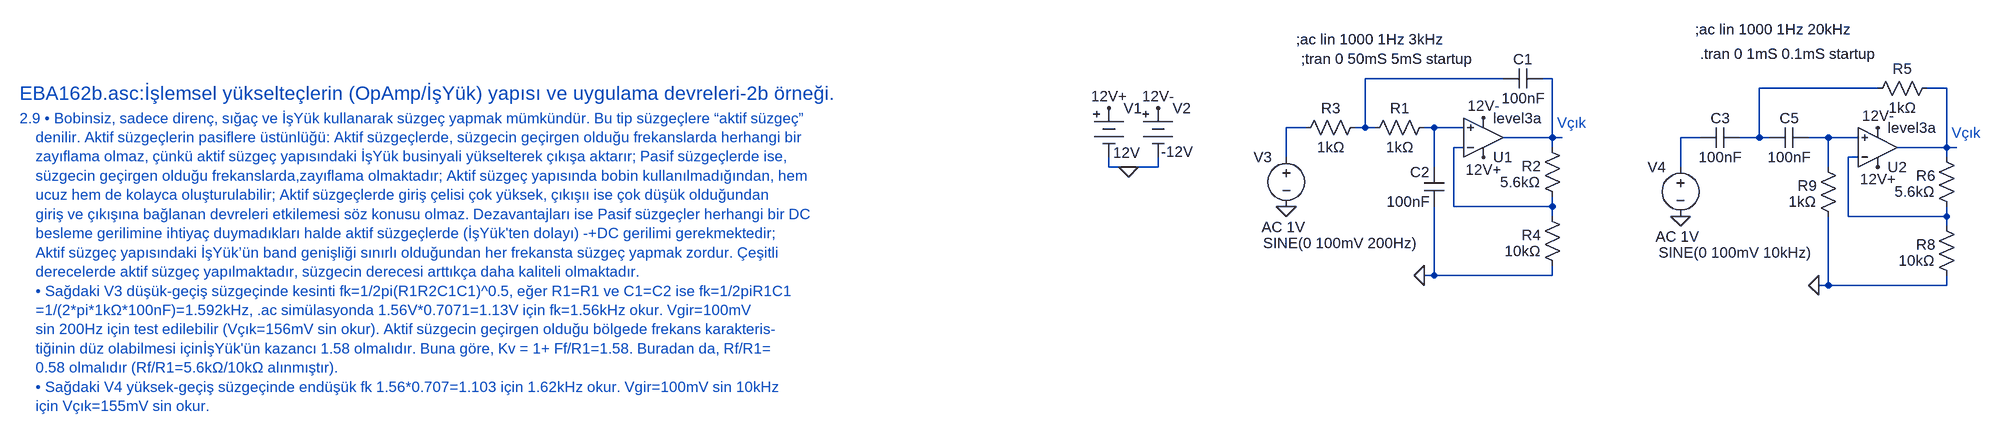
[diagram p0: schematic EBA162b.asc]
EBA162b.asc, the LTspice schematic file:
Version 4
SHEET 1 6044 4332
WIRE 2176 32 1952 32
WIRE 2256 32 2240 32
WIRE 2784 48 2592 48
WIRE 2896 48 2864 48
WIRE 1856 112 1824 112
WIRE 1952 112 1952 32
WIRE 1952 112 1936 112
WIRE 1968 112 1952 112
WIRE 2064 112 2048 112
WIRE 2112 112 2064 112
WIRE 2256 128 2256 32
WIRE 2256 128 2176 128
WIRE 2272 128 2256 128
WIRE 2496 128 2464 128
WIRE 2592 128 2592 48
WIRE 2592 128 2560 128
WIRE 2608 128 2592 128
WIRE 2704 128 2672 128
WIRE 2752 128 2704 128
WIRE 2112 144 2096 144
WIRE 2256 144 2256 128
WIRE 2896 144 2896 48
WIRE 2896 144 2816 144
WIRE 2912 144 2896 144
WIRE 1824 160 1824 112
WIRE 2752 160 2736 160
WIRE 2896 160 2896 144
WIRE 1536 176 1536 160
WIRE 1568 176 1536 176
WIRE 1616 176 1616 160
WIRE 1616 176 1568 176
WIRE 2064 176 2064 112
WIRE 2464 176 2464 128
WIRE 2704 176 2704 128
WIRE 2096 240 2096 144
WIRE 2256 240 2256 224
WIRE 2256 240 2096 240
WIRE 2256 256 2256 240
WIRE 2736 256 2736 160
WIRE 2896 256 2896 240
WIRE 2896 256 2736 256
WIRE 2896 272 2896 256
WIRE 2064 352 2064 240
WIRE 2064 352 2048 352
WIRE 2256 352 2256 336
WIRE 2256 352 2064 352
WIRE 2704 368 2704 256
WIRE 2704 368 2688 368
WIRE 2896 368 2896 352
WIRE 2896 368 2704 368
FLAG 1536 80 12V+
FLAG 1616 80 12V-
FLAG 1568 176 0
FLAG 2144 160 12V+
FLAG 1824 240 0
FLAG 2048 352 0
FLAG 2144 96 12V-
FLAG 2784 176 12V+
FLAG 2464 256 0
FLAG 2688 368 0
FLAG 2784 112 12V-
SYMBOL Misc\\battery 1536 64 R0
WINDOW 3 7 88 Left 2
SYMATTR Value 12V
SYMATTR InstName V1
SYMBOL Misc\\battery 1616 64 R0
WINDOW 3 5 87 Left 2
SYMATTR Value -12V
SYMATTR InstName V2
SYMBOL res 2064 96 R90
WINDOW 0 0 56 VBottom 2
WINDOW 3 32 56 VTop 2
SYMATTR InstName R1
SYMATTR Value 1kΩ
SYMBOL OpAmps\\UniversalOpAmp3 2144 128 M180
SYMATTR InstName U1
SYMBOL res 2272 240 R180
WINDOW 0 35 66 Left 2
WINDOW 3 36 40 Left 2
SYMATTR InstName R2
SYMATTR Value 5.6kΩ
SYMBOL cap 2240 16 R90
WINDOW 0 0 32 VBottom 2
WINDOW 3 32 32 VTop 2
SYMATTR InstName C1
SYMATTR Value 100nF
SYMBOL res 1952 96 R90
WINDOW 0 0 56 VBottom 2
WINDOW 3 32 56 VTop 2
SYMATTR InstName R3
SYMATTR Value 1kΩ
SYMBOL voltage 1824 144 M0
WINDOW 3 -208 155 Left 2
WINDOW 123 -29 129 Left 2
WINDOW 39 0 0 Left 0
SYMATTR InstName V3
SYMATTR Value SINE(0 100mV 200Hz)
SYMATTR Value2 AC 1V
SYMBOL res 2272 352 R180
WINDOW 0 35 66 Left 2
WINDOW 3 36 40 Left 2
SYMATTR InstName R4
SYMATTR Value 10kΩ
SYMBOL cap 2080 240 R180
WINDOW 0 24 56 Left 2
WINDOW 3 24 8 Left 2
SYMATTR InstName C2
SYMATTR Value 100nF
SYMBOL res 2880 32 R90
WINDOW 0 0 56 VBottom 2
WINDOW 3 32 56 VTop 2
SYMATTR InstName R5
SYMATTR Value 1kΩ
SYMBOL OpAmps\\UniversalOpAmp3 2784 144 M180
SYMATTR InstName U2
SYMBOL res 2912 256 R180
WINDOW 0 35 66 Left 2
WINDOW 3 36 40 Left 2
SYMATTR InstName R6
SYMATTR Value 5.6kΩ
SYMBOL cap 2496 144 R270
WINDOW 0 32 32 VTop 2
WINDOW 3 0 32 VBottom 2
SYMATTR InstName C3
SYMATTR Value 100nF
SYMBOL voltage 2464 160 M0
WINDOW 3 -208 155 Left 2
WINDOW 123 -29 129 Left 2
WINDOW 39 0 0 Left 0
SYMATTR InstName V4
SYMATTR Value SINE(0 100mV 10kHz)
SYMATTR Value2 AC 1V
SYMBOL res 2912 368 R180
WINDOW 0 35 66 Left 2
WINDOW 3 36 40 Left 2
SYMATTR InstName R8
SYMATTR Value 10kΩ
SYMBOL cap 2608 144 R270
WINDOW 0 32 32 VTop 2
WINDOW 3 0 32 VBottom 2
SYMATTR InstName C5
SYMATTR Value 100nF
SYMBOL res 2720 272 R180
WINDOW 0 35 66 Left 2
WINDOW 3 36 40 Left 2
SYMATTR InstName R9
SYMATTR Value 1kΩ
TEXT -232 56 Left 3 ;EBA162b.asc:İşlemsel yükselteçlerin (OpAmp/İşYük) yapısı ve uygulama devreleri-2b örneği.
TEXT -232 96 Left 2 ;2.9 • Bobinsiz, sadece direnç, sığaç ve İşYük kullanarak süzgeç yapmak mümkündür. Bu tip süzgeçlere “aktif süzgeç”\n    denilir. Aktif süzgeçlerin pasiflere üstünlüğü: Aktif süzgeçlerde, süzgecin geçirgen olduğu frekanslarda herhangi bir \n    zayıflama olmaz, çünkü aktif süzgeç yapısındaki İşYük businyali yükselterek çıkışa aktarır; Pasif süzgeçlerde ise, \n    süzgecin geçirgen olduğu frekanslarda,zayıflama olmaktadır; Aktif süzgeç yapısında bobin kullanılmadığından, hem \n    ucuz hem de kolayca oluşturulabilir; Aktif süzgeçlerde giriş çelisi çok yüksek, çıkışıı ise çok düşük olduğundan\n    giriş ve çıkışına bağlanan devreleri etkilemesi söz konusu olmaz. Dezavantajları ise Pasif süzgeçler herhangi bir DC\n    besleme gerilimine ihtiyaç duymadıkları halde aktif süzgeçlerde (İşYük'ten dolayı) -+DC gerilimi gerekmektedir;\n    Aktif süzgeç yapısındaki İşYük’ün band genişliği sınırlı olduğundan her frekansta süzgeç yapmak zordur. Çeşitli \n    derecelerde aktif süzgeç yapılmaktadır, süzgecin derecesi arttıkça daha kaliteli olmaktadır. \n    • Sağdaki V3 düşük-geçiş süzgeçinde kesinti fk=1/2pi(R1R2C1C1)^0.5, eğer R1=R1 ve C1=C2 ise fk=1/2piR1C1\n    =1/(2*pi*1kΩ*100nF)=1.592kHz, .ac simülasyonda 1.56V*0.7071=1.13V için fk=1.56kHz okur. Vgir=100mV \n    sin 200Hz için test edilebilir (Vçık=156mV sin okur). Aktif süzgecin geçirgen olduğu bölgede frekans karakteris-\n    tiğinin düz olabilmesi içinİşYük'ün kazancı 1.58 olmalıdır. Buna göre, Kv = 1+ Ff/R1=1.58. Buradan da, Rf/R1= \n    0.58 olmalıdır (Rf/R1=5.6kΩ/10kΩ alınmıştır).\n    • Sağdaki V4 yüksek-geçiş süzgeçinde endüşük fk 1.56*0.707=1.103 için 1.62kHz okur. Vgir=100mV sin 10kHz\n    için Vçık=155mV sin okur.
TEXT 2264 104 Left 2 ;Vçık
TEXT 1848 0 Left 2 !;tran 0 50mS 5mS startup
TEXT 1840 -32 Left 2 !;ac lin 1000 1Hz 3kHz
TEXT 2904 120 Left 2 ;Vçık
TEXT 2496 -8 Left 2 !.tran 0 1mS 0.1mS startup
TEXT 2488 -48 Left 2 !;ac lin 1000 1Hz 20kHz

The netlist it stands for:
* EBA162b.asc
V1 12V+ 0 12V
V2 12V- 0 -12V
R1 N006 N001 1kΩ
XU1 N006 N009 12V+ 12V- N002 level3a  ; pins In+ In- V+ V- OUT
R2 N009 N002 5.6kΩ
C1 N002 N001 100nF
R3 N001 N005 1kΩ
V3 N005 0 SINE(0 100mV 200Hz) AC 1V
R4 0 N009 10kΩ
C2 0 N006 100nF
R5 N004 N003 1kΩ
XU2 N008 N010 12V+ 12V- N004 level3a  ; pins In+ In- V+ V- OUT
R6 N010 N004 5.6kΩ
C3 N007 N003 100nF
V4 N007 0 SINE(0 100mV 10kHz) AC 1V
R8 0 N010 10kΩ
C5 N003 N008 100nF
R9 0 N008 1kΩ
* EBA162b.asc:İşlemsel yükselteçlerin (OpAmp/İşYük) yapısı ve uygulama devreleri-2b örneği.
* 2.9 • Bobinsiz, sadece direnç, sığaç ve İşYük kullanarak süzgeç yapmak mümkündür. Bu tip süzgeçlere “aktif süzgeç”
*     denilir. Aktif süzgeçlerin pasiflere üstünlüğü: Aktif süzgeçlerde, süzgecin geçirgen olduğu frekanslarda herhangi bir
*     zayıflama olmaz, çünkü aktif süzgeç yapısındaki İşYük businyali yükselterek çıkışa aktarır; Pasif süzgeçlerde ise,
*     süzgecin geçirgen olduğu frekanslarda,zayıflama olmaktadır; Aktif süzgeç yapısında bobin kullanılmadığından, hem
*     ucuz hem de kolayca oluşturulabilir; Aktif süzgeçlerde giriş çelisi çok yüksek, çıkışıı ise çok düşük olduğundan
*     giriş ve çıkışına bağlanan devreleri etkilemesi söz konusu olmaz. Dezavantajları ise Pasif süzgeçler herhangi bir DC
*     besleme gerilimine ihtiyaç duymadıkları halde aktif süzgeçlerde (İşYük'ten dolayı) -+DC gerilimi gerekmektedir;
*     Aktif süzgeç yapısındaki İşYük’ün band genişliği sınırlı olduğundan her frekansta süzgeç yapmak zordur. Çeşitli
*     derecelerde aktif süzgeç yapılmaktadır, süzgecin derecesi arttıkça daha kaliteli olmaktadır.
*     • Sağdaki V3 düşük-geçiş süzgeçinde kesinti fk=1/2pi(R1R2C1C1)^0.5, eğer R1=R1 ve C1=C2 ise fk=1/2piR1C1
*     =1/(2*pi*1kΩ*100nF)=1.592kHz, .ac simülasyonda 1.56V*0.7071=1.13V için fk=1.56kHz okur. Vgir=100mV
*     sin 200Hz için test edilebilir (Vçık=156mV sin okur). Aktif süzgecin geçirgen olduğu bölgede frekans karakteris-
*     tiğinin düz olabilmesi içinİşYük'ün kazancı 1.58 olmalıdır. Buna göre, Kv = 1+ Ff/R1=1.58. Buradan da, Rf/R1=
*     0.58 olmalıdır (Rf/R1=5.6kΩ/10kΩ alınmıştır).
*     • Sağdaki V4 yüksek-geçiş süzgeçinde endüşük fk 1.56*0.707=1.103 için 1.62kHz okur. Vgir=100mV sin 10kHz
*     için Vçık=155mV sin okur.
* Vçık
;tran 0 50mS 5mS startup
;ac lin 1000 1Hz 3kHz
* Vçık
.tran 0 1mS 0.1mS startup
;ac lin 1000 1Hz 20kHz
.backanno
.end